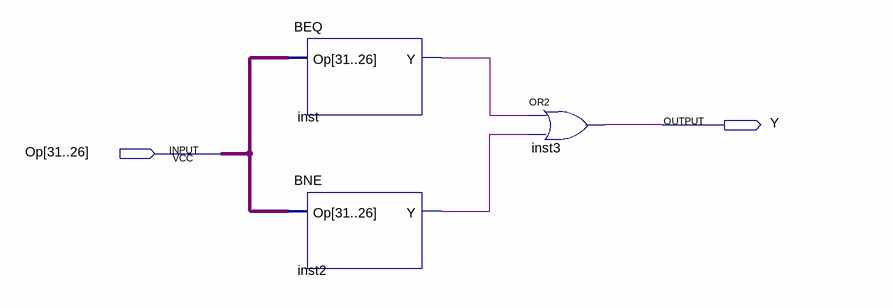
[diagram p0: schematic sheet]
// Quartus schematic BRANCH.bdf as structural Verilog: 3 symbols, 2 pins
module BRANCH (
  input  [31:26] Op,
  output Y
);

  wire inst2_y, inst_y;

  BEQ inst (.Op(Op), .Y(inst_y));
  BNE inst2 (.Op(Op), .Y(inst2_y));
  or inst3 (Y, inst_y, inst2_y);
endmodule
